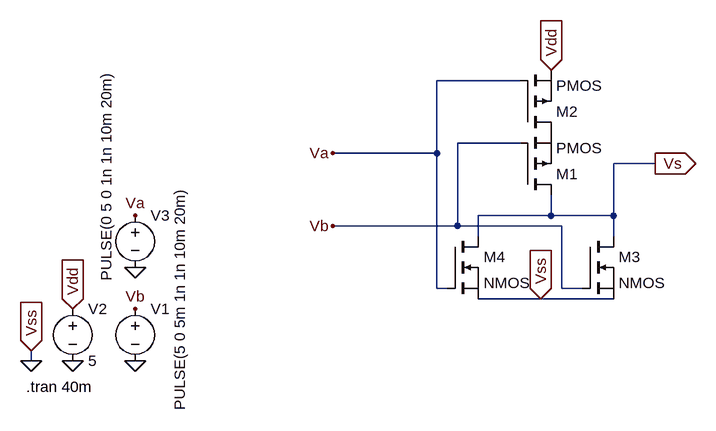
[diagram p0: schematic NOU.asc]
NOU.asc, the LTspice schematic file:
Version 4
SHEET 1 880 680
WIRE -208 -608 -336 -608
WIRE -208 -512 -304 -512
WIRE -336 -496 -336 -608
WIRE -336 -496 -496 -496
WIRE 0 -480 -64 -480
WIRE -160 -400 -160 -432
WIRE -160 -400 -272 -400
WIRE -64 -400 -64 -480
WIRE -64 -400 -160 -400
WIRE -304 -384 -304 -512
WIRE -304 -384 -496 -384
WIRE -144 -384 -304 -384
WIRE -272 -368 -272 -400
WIRE -64 -368 -64 -400
WIRE -336 -288 -336 -496
WIRE -320 -288 -336 -288
WIRE -144 -288 -144 -384
WIRE -112 -288 -144 -288
WIRE -176 -272 -272 -272
WIRE -64 -272 -176 -272
WIRE -960 -176 -960 -192
FLAG -800 -176 0
FLAG -800 -256 Vb
FLAG -960 -176 0
FLAG -960 -192 Vss
IOPIN -960 -192 In
FLAG -896 -176 0
FLAG -896 -256 Vdd
IOPIN -896 -256 In
FLAG -800 -320 0
FLAG -800 -400 Va
FLAG -496 -496 Va
FLAG -496 -384 Vb
FLAG -160 -624 Vdd
IOPIN -160 -624 In
FLAG -176 -272 Vss
IOPIN -176 -272 In
FLAG 0 -480 Vs
IOPIN 0 -480 Out
SYMBOL voltage -800 -272 R0
WINDOW 3 69 172 VLeft 2
WINDOW 123 0 0 Left 0
WINDOW 39 0 0 Left 0
SYMATTR InstName V1
SYMATTR Value PULSE(5 0 5m 1n 1n 10m 20m)
SYMBOL voltage -896 -272 R0
SYMATTR InstName V2
SYMATTR Value 5
SYMBOL voltage -800 -416 R0
WINDOW 3 -44 117 VLeft 2
WINDOW 123 0 0 Left 0
WINDOW 39 0 0 Left 0
SYMATTR InstName V3
SYMATTR Value PULSE(0 5 0 1n 1n 10m 20m)
SYMBOL pmos -208 -432 M180
SYMATTR InstName M1
SYMBOL pmos -208 -528 M180
SYMATTR InstName M2
SYMBOL nmos -112 -368 R0
SYMATTR InstName M3
SYMBOL nmos -320 -368 R0
SYMATTR InstName M4
TEXT -968 -136 Left 2 !.tran 40m

The netlist it stands for:
* NOU.asc
V1 Vb 0 PULSE(5 0 5m 1n 1n 10m 20m)
V2 Vdd 0 5
V3 Va 0 PULSE(0 5 0 1n 1n 10m 20m)
M1 Vs Vb P001 P001 PMOS
M2 P001 Va Vdd Vdd PMOS
M3 Vs Vb 0 0 NMOS
M4 Vs Va 0 0 NMOS
.model NMOS NMOS
.model PMOS PMOS
.lib standard.mos
.tran 40m
.backanno
.end